# EAGLE schematic FM-Radio-Simple-Receiver (EAGLE 7.2.0)
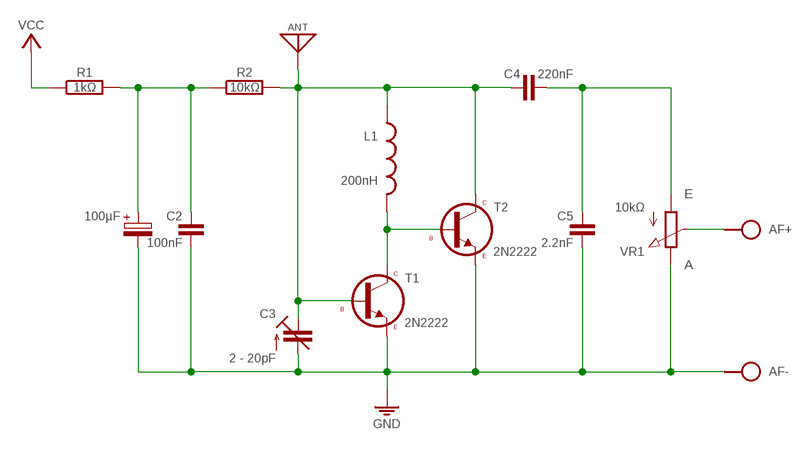
[diagram p0: schematic, sheet 1]

## Parts
100µF  CPOLE2,5-5/V  [E2,5-5/V]
AF  SPAD+-+-  [SPAD+-]
ANT  ANT  [SPAD]
BAT  VCC_GNDL  [SPAD-+]
C2  100nF  C050-020X036/V  [C050-020X036/V]
C3  2 - 20pF  C-TR-PH20127  [TRIM-2222-808]
C4  220nF  C-H050-020X044  [C050-020X044]
C5  2.2nF  C050-020X036/V  [C050-020X036/V]
L1  200nH  L04/7-V  [L-04/7-V]
R1  1kΩ  R-H0204/10  [0204/10]
R2  10kΩ  R-H0204/10  [0204/10]
T1  2N2222  [TO92-EBC]
T2  2N2222  [TO92-EBC]
VR1  10kΩ  POT  [POT]

## Nets
GND: 100µF.- AF.1 BAT.1 C2.2 C3.1(A) C3.3(A) C5.2 T1.E T2.E VR1.E
N$1: ANT.1 C3.2(E) C4.1 L1.1 R2.2 T1.B T2.C
N$2: 100µF.+ C2.1 R1.2 R2.1
N$3: C4.2 C5.1 VR1.A
N$5: L1.2 T1.C T2.B
N$6: AF.2 VR1.S
VCC: BAT.2 R1.1

## Library data of the parts
100µF = c:CPOL: POLARIZED CAPACITOR, European symbol
AF = pad:SPAD+-
ANT = pad:ANT
BAT = pad:VCC_GND
C2 C5 = c:C: CAPACITOR, European symbol
C3 = cap-trim:C-TR-PH20127
C4 = c:C-H
L1 = l:L: Potentiometers Beckman, Copal, Piher, Spectrol, Schukat Created by librarian@cadsoft.de
R1 R2 = r:R-H
T1 T2 = t:2N2222
VR1 = r:POT